# EAGLE schematic termostat (EAGLE 8.7.0)
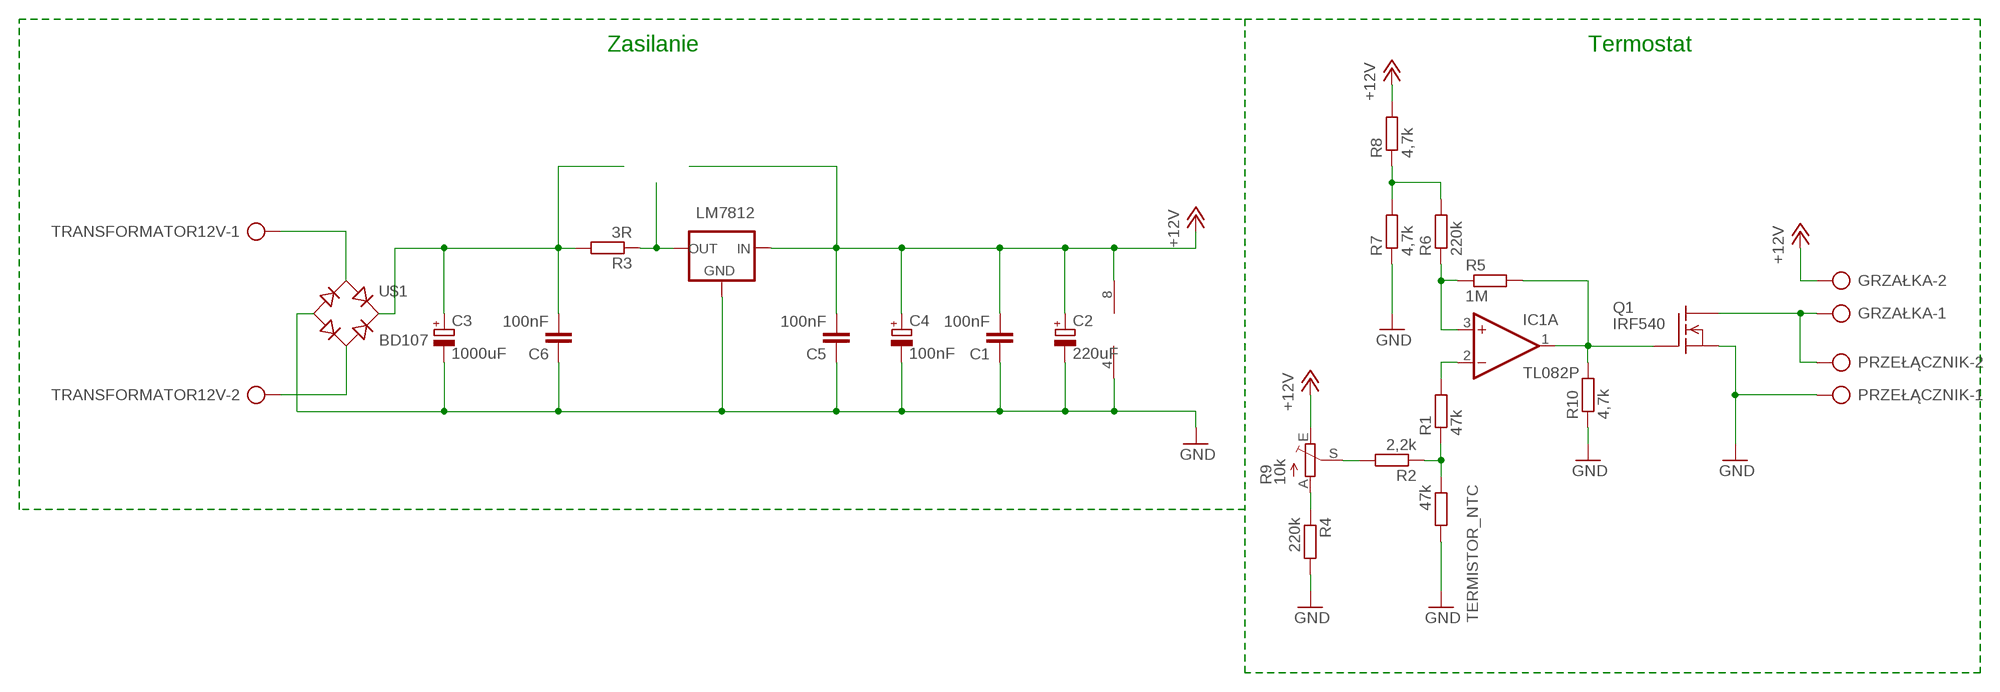
[diagram p0: schematic, sheet 1]

## Parts
C1  100nF  C-EU050-045-075  [C50-45-75]
C2  220uF  C-EU-POL'  [E2,5-6]
C3  1000uF  C-EU-POL  [E5-13]
C4  100nF  C-EU-POL'  [E2,5-6]
C5  100nF  C-EU050-045-075  [C50-45-75]
C6  100nF  C-EU050-045-075  [C50-45-75]
GRZAŁKA  AK300/2  [AK300/2]
IC1  TL082P  [DIL08]
LM7812  79XXS  [79XXS]
PRZEŁĄCZNIK  AK300/2  [AK300/2]
Q1  IRF540  [TO220]
R1  47k  R-EU7  [204/7]
R2  2,2k  R-EU7  [204/7]
R3  3R  R-EU7  [204/7]
R4  220k  R-EU7  [204/7]
R5  1M  R-EU7  [204/7]
R6  220k  R-EU7  [204/7]
R7  4,7k  R-EU7  [204/7]
R8  4,7k  R-EU7  [204/7]
R9  10k  TRIM_EU-CA6V  [CA6V]
R10  4,7k  R-EU7  [204/7]
TERMISTOR_NTC  47k  R-EU7  [204/7]
TRANSFORMATOR12V  AK300/2  [AK300/2]
U$1  BD107  [B-DIL]

## Nets
+12V: C1.P$2 C2.P$1(+) C4.P$1(+) C5.P$2 GRZAŁKA.2 IC1.8(P:V+) LM7812.IN R8.P$2 R9.E
GND: C1.P$1 C2.P$2(-) C3.P$2(-) C4.P$2(-) C5.P$1 C6.P$1 IC1.4(P:V-) LM7812.GND PRZEŁĄCZNIK.1 Q1.3(S) R4.P$2 R7.P$1 R10.P$1 TERMISTOR_NTC.P$2 U$1.-
N$1: R6.P$2 R7.P$2 R8.P$1
N$3: IC1.3(A:+IN) R5.P$1 R6.P$1
N$4: IC1.1(A:OUT) Q1.1(G) R5.P$2 R10.P$2
N$5: GRZAŁKA.1 PRZEŁĄCZNIK.2 Q1.2(D)
N$6: IC1.2(A:-IN) R1.P$2
N$7: R2.P$2 R9.S
N$8: R1.P$1 R2.P$1 TERMISTOR_NTC.P$1
N$9: R4.P$1 R9.A
N$10: TRANSFORMATOR12V.1 U$1.AC1
N$11: TRANSFORMATOR12V.2 U$1.AC2
N$12: C3.P$1(+) C6.P$2 R3.P$2 U$1.+
N$13: LM7812.OUT R3.P$1
Unconnected: IC1.5(B:+IN) IC1.6(B:-IN) IC1.7(B:OUT)

## Notes on the sheet
- Zasilanie | Termostat

## Library data of the parts
C1 C5 C6 = RCL!:C-EU
C2-C4 = RCL!:C-EU-POL
GRZAŁKA PRZEŁĄCZNIK TRANSFORMATOR12V = con-ptr500:AK300/2: CONNECTOR; OC_FARNELL: unknown; OC_NEWARK: unknown
IC1 = linear:TL082: OP AMP Data sheet <http://www.ti.com/lit/ds/symlink/tl084a . pdf>; DATA_SHEET: <a href="http://www.ti.com/lit/ds/symlink/tl084a.pdf"> Data sheet </a>
LM7812 = v-reg:79XXS: VOLTAGE REGULATOR
Q1 = transistor-fet:IRF540: N-Channel Enhancement MOSFET (HEXFET); 100V; 28A; 0,077Ohm
R1-R8 R10 TERMISTOR_NTC = RCL!:R-EU
R9 = pot:TRIM_EU-: POTENTIOMETER
U$1 = Diody, mostki:BD107